# Altium schematic sheet power.SchDoc
size A4; SPICEModelCacheCVNPFVZF: <root> / <DocumentId>CVNPFVZF</DocumentId> / <CacheFrame Number="0"> / <Model Name="cap" Kind="MDL"> / <Text>*Default semiconductor capacitor / .MODEL CAP C()</Text> / </Model> / <Model Name="zener" Kind="MDL"> / <Text>*ZENER / *Default Zener 10V @ 10mA / *Zener Diode Pinout: A,K / .MODEL ZENER D( BV=10 IBV=10E-3 )</Text> / </Model> / </CacheFrame> / </root>
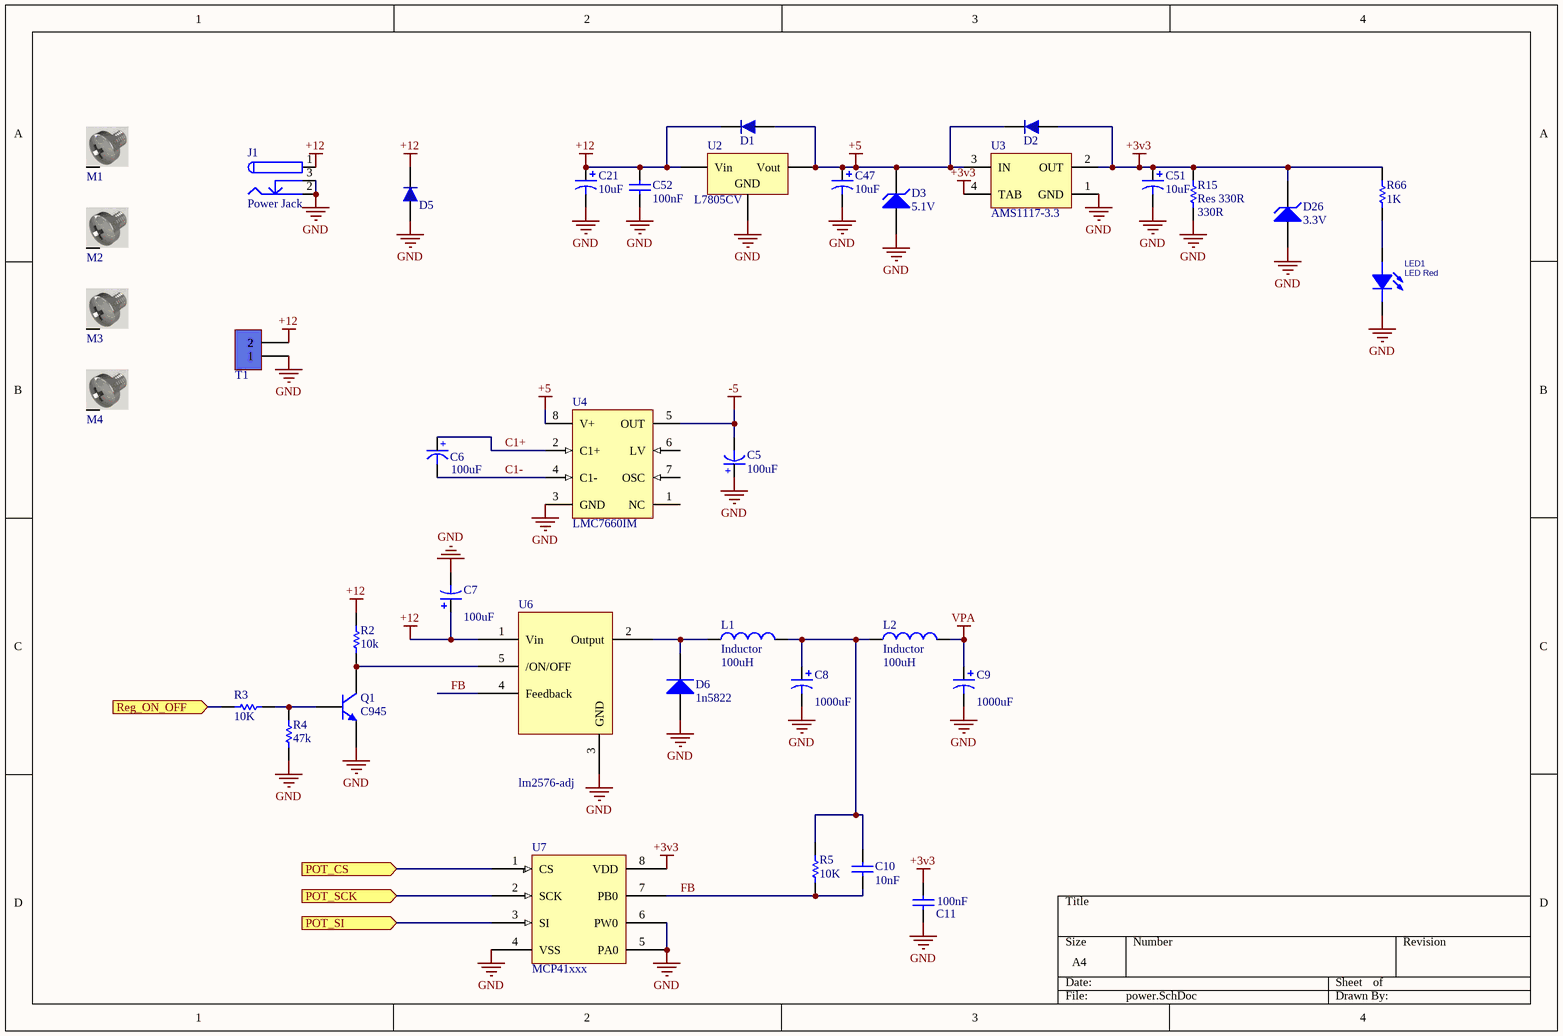
[diagram p0: power.SchDoc]

## Parts
C5  100uF  [Cap SMD electrolite-6.3mm]
C6  100uF  [Cap SMD electrolite-6.3mm]
C7  value 100uF  [Cap SMD electrolite-6.3mm]
C8  value 1000uF  [Cap SMD electrolite-10.3mm]
C9  value 1000uF  [Cap SMD electrolite-10.3mm]
C10  10nF  [SMD_CAP_0805]
C11  100nF  [SMD_CAP_0805]
C21  value 10uF  [CAP0805]  (hidden comment: cap 10uF)
C47  value 10uF  [CAP0805]  (hidden comment: cap 10uF)
C51  value 10uF  [CAP0805]  (hidden comment: cap 10uF)
C52  value 100nF  [CAP0805]  (hidden comment: cap 100nF)
D1  uf4007  [DIOM4629X24N]  (value not drawn)
D2  uf4007  [DIOM4629X24N]  (value not drawn)
D3  5.1V  [Diode 1n4148 SMD]
D5  uf4007  [DIOM4629X24N]  (value not drawn)
D6  1n5822  [DO214AC SMA]
D26  3.3V  [Diode 1n4148 SMD]
J1  Power Jack  [Power Jack]
L1  Inductor  value 100uH  [inductor]
L2  Inductor  value 100uH  [inductor]
LED1  LED Red  [led_0805]
M1  Screw  [Screw]  (value not drawn)
M2  Screw  [Screw]  (value not drawn)
M3  Screw  [Screw]  (value not drawn)
M4  Screw  [Screw]  (value not drawn)
Q1  C945  [SOT23_N]
R2  10k  [RES 0805 (2012X06L)]
R3  10K  [RES 0805 (2012X06L)]
R4  47k  [RES 0805 (2012X06L)]
R5  10K  [RES 0805 (2012X06L)]
R15  Res 330R  value 330R  [RES0805]
R66  1K  [RES 0805 (2012X06L)]
T1  Terminal  [Terminal 1*2_1]  (value not drawn)
U2  L7805CV  [REG-7805-smd]
U3  AMS1117-3.3  [SOT223]
U4  LMC7660IM  [M08A_N]
U6  lm2576-adj  [2596]
U7  MCP41xxx  [SO8_M]

## Ports
POT_CS (in), POT_SCK (in), POT_SI (in), Reg_ON_OFF (in)

## Nets
+3v3: C11.2 C51.1 D2.1 D26.2(K) R15.2 R66.2 U3.2(OUT) U3.4(TAB) U7.8(VDD)
+5: C47.1 D1.1 D2.2 D3.2(K) U2.3(Vout) U3.3(IN) U4.8(V+)
+12: C7.1 C21.1 C52.1 D1.2 D5.2 J1.1 R2.2 T1.2 U2.1(Vin) U6.1(Vin)
-5: C5.2(-) U4.5(OUT)
GND: C5.1(+) C7.2 C8.2 C9.2 C11.1 C21.2 C47.2 C51.2 C52.2 D3.1(A) D5.1 D6.1(A) D26.1(A) J1.2 J1.3 LED1.2(CATHODE) Q1.2(E) R4.1 R15.1 T1.1 U2.2(GND) U3.1(GND) U4.3(GND) U6.3(GND) U7.4(VSS) U7.5(PA0) U7.6(PW0)
VPA: C9.1 L2.2
C1+: C6.1(+) U4.2(C1+)
C1-: C6.2(-) U4.4(C1-)
FB: C10.2 R5.1 U6.4(Feedback) U7.7(PB0)
POT_CS: U7.1(CS) ; port POT_CS
POT_SCK: U7.2(SCK) ; port POT_SCK
POT_SI: U7.3(SI) ; port POT_SI
Reg_ON_OFF: R3.1 ; port Reg_ON_OFF
NetC8_1: C8.1 C10.1 L1.2 L2.1 R5.2
NetD6_2: D6.2(K) L1.1 U6.2(Output)
NetLED1_1: LED1.1(ANODE) R66.1
NetQ1_1: Q1.1(B) R3.2 R4.2
NetQ1_3: Q1.3(C) R2.1 U6.5(/ON/OFF)

Not connected (* = marked no-connect by the designer): M1 S; M2 S; M3 S; M4 S; U4 1(NC) 6(LV) 7(OSC)

## Library data of the parts
C5 C6 = Cap-Polar: Polar Capacitor; Designer: Saeid Jorablo; Organazation: ControTec; Voltage: 16V; Adding Date: 1387/12/20; Value: 100uF
C7-C9 = Cap Pol1: Polarized Capacitor (Radial); Published: 8-Jun-2000; LatestRevisionDate: 17-Jul-2002; LatestRevisionNote: Re-released for DXP Platform.; PackageReference: RB7.6-15; Publisher: Altium Limited; PackageDescription: Polarized Capacitor (Radial); 2 Leads
C10 C11 = Cap ceramic: CAP-100Nf
  C10: Value: 10nF
  C11: Value: 100nF
C21 C47 C51 = Cap Pol1: CAP seramic; Published: 8-Jun-2000; LatestRevisionDate: 17-Jul-2002; LatestRevisionNote: Re-released for DXP Platform.; PackageReference: RB7.6-15; Publisher: Altium Limited; PackageDescription: Polarized Capacitor (Radial); 2 Leads
C52 = Cap ceramic: CAP seramic
D1 D2 D5 = 1n4007 SMD M7: Standard Rectifiers; Part. No: M7; Manufacturer: DC COMPONENTS; Designer: Abbas Basereh; Link: http://www.tme.eu/en/details/m7/smd-universal-diodes/dc-components/; Link: https://www.aliexpress.com/item/Smd-tube-1n4007-m7-SMA/1213719741.html?spm=2114.01010208.3.1.ZyZ7bC&ws_ab_test=searchweb0_0,searchweb201602_4_10065_10068_10084_10083_10080_10082_10081_10060_10061_10062_10056_10055_10054_10059_10099_10078_10079_427_10073_10103_10102_10096_10052_10050_10051,searchweb201603_4&btsid=db2be5ca-e560-400a-b91c-484ab5ee228b; Data: 16-12-2016
D3 D26 = D Zener: Zener Diode; Published: 8-Jun-2000; LatestRevisionDate: 17-Jul-2002; LatestRevisionNote: Re-released for DXP Platform.; PackageReference: DIODE-0.7; Publisher: Altium Limited; PackageDescription: Diode, Thru-Hole; 2 Leads; 0.7 in Pin Spacing
D6 = Diode 1N4007: 1 Amp General Purpose Rectifier; Published: 8-Jun-2000; LatestRevisionDate: 17-Jul-2002; LatestRevisionNote: Re-released for DXP Platform.; DatasheetVersion: 1998; PackageVersion: Aug-1999; PackageReference: DO-41; Publisher: Altium Limited; PackageDescription: Diode, Axial; Body 5.2 x 2.7 mm (LxDia. max), Lead Dia. 0.86 mm (max); Code_JEDEC: DO-204-AL; ComponentLink1Description: Manufacturer Link; ComponentLink1URL: http://www.fairchildsemi.com/; ComponentLink2Description: Datasheet; ComponentLink2URL: http://www.fairchildsemi.com/ds/1N%2F1N4001.pdf
J1 = Power Jack: Designer: Saeid Jorablo; Company: Personal; Project Name: Laser; Adding Date: 10/21/2009
L1 = Inductor: SMD Inductor; Code_IEC: 1005; Published: 8-Jun-2000; LatestRevisionDate: 29-May-2009; LatestRevisionNote: IPC-7351 Footprint Added.; PackageReference: 0402-A; Publisher: Altium Limited; PackageDescription: Chip Inductor; Code_JEITA: 0402
L2 = Inductor: Code_IEC: 1005; Published: 8-Jun-2000; LatestRevisionDate: 29-May-2009; LatestRevisionNote: IPC-7351 Footprint Added.; PackageReference: 0402-A; Publisher: Altium Limited; PackageDescription: Chip Inductor; Code_JEITA: 0402
LED1 = LED 5MM: Light Emitting Diode; Designer: Abbas Basereh; Data: 16-12-2016; Link: *; Part.No: *
M1-M4 = Board Screw: Board Screw With Spacer
Q1 = C945: NPN Silicon Epitaxial Planar Transistor; Published: 2017-2-8; LatestRevisionDate: 2017; LatestRevisionNote: IPC-7351 Footprint Added.; DatasheetVersion: 2017; PackageVersion: 2017-2-8; PackageReference: SOT23; Publisher: Abbas Basereh; PackageDescription: 3-Pin SOT-23 Package 0.95 mm Pitch, 2.3 mm Lead Span; ComponentLink1Description: Manufacturer Link; ComponentLink1URL: http://www.taitroncomponents.com/; ComponentLink2Description: Datasheet; ComponentLink2URL: http://www.taitroncomponents.com/
R2-R4 R15 = Res1: Resistor; Published: 8-Jun-2000; LatestRevisionDate: 17-Jul-2002; LatestRevisionNote: Re-released for DXP Platform.; PackageReference: AXIAL-0.3; Publisher: Altium Limited; PackageDescription: Axial Device, Thru-Hole; 2 Leads; 0.3 in Pin Spacing
  R2: Value: 10k
  R3: Value: 10K
  R4: Value: 47k
R5 R66 = RES Axial 0.25W: Designer: Abbas Basereh; Desc.: RES Axial 0.25W; Data: 4-1-2017
T1 = Terminal 1*2: Terminal 2 Pin 250VAC 16A; Designer: Seyed Mohsen Ghasemain; E-mail: picpars@gmail.com; ComponentLinkURL: www.picpars.com
U2 = L7805CV-Linear Voltage Regulator IC Positive 1 Output 5V 1.5A TO-220AB: Linear Voltage Regulator IC Positive FIXED; Manufacturer: STMicroelectronics; Designer: Abbas Basereh; Link: https://www.aliexpress.com/item/; Link: http://www.tme.eu/en/; Link: http://www.digikey.com/; Part. No: L7805CV
U3 = AMS1117-x.x: x.x Volt, 800mA Low-Dropout Linear Regulator, 4-pin SOT-223; Designer: Ali Hafizi; Data: 16-12-2016
U4 = LMC7660IM: Switched Capacitor Voltage Converter; Manufacturer: National Semiconductor; CompType: Switch Caps; PackageTopMarking: NSZXTT*LMC76*60IM; PowerWise: N; Published: 4-Dec-2008; DatasheetVersion: Feb-2005; PackageVersion: revL, Sep-2006; PackageReference: M08A; Publisher: Altium Limited; PackageDescription: SOIC Narrow, 4.9 x 3.9 x 1.45mm, 8 Lead, 1.27mm Pitch; PartNumber: LMC7660IM; RoHS: O; PinCount: 8; DigiKeyPartNumber: LMC7660IM-ND; Code_JEDEC: MS-012-AA; Code_IPC: SOIC127P600-8; ComponentLink1Description: LMC7660 Datasheet; ComponentLink1URL: http://www.national.com/ds/LM/LMC7660.pdf; ComponentLink2Description: LMC7660 Web Page; ComponentLink2URL: http://www.national.com/pf/LM/LMC7660.html; ComponentLink3Description: M08A Package Page; ComponentLink3URL: http://www.national.com/packaging/folders/m08a.html
U6 = lm2596